# Altium schematic sheet MCU.SchDoc: MCU
size A3; DocumentNumber: MB1246; Revision: B.1; SheetNumber: 2; SheetTotal: 17; Project: STM32H7xxI-EVAL
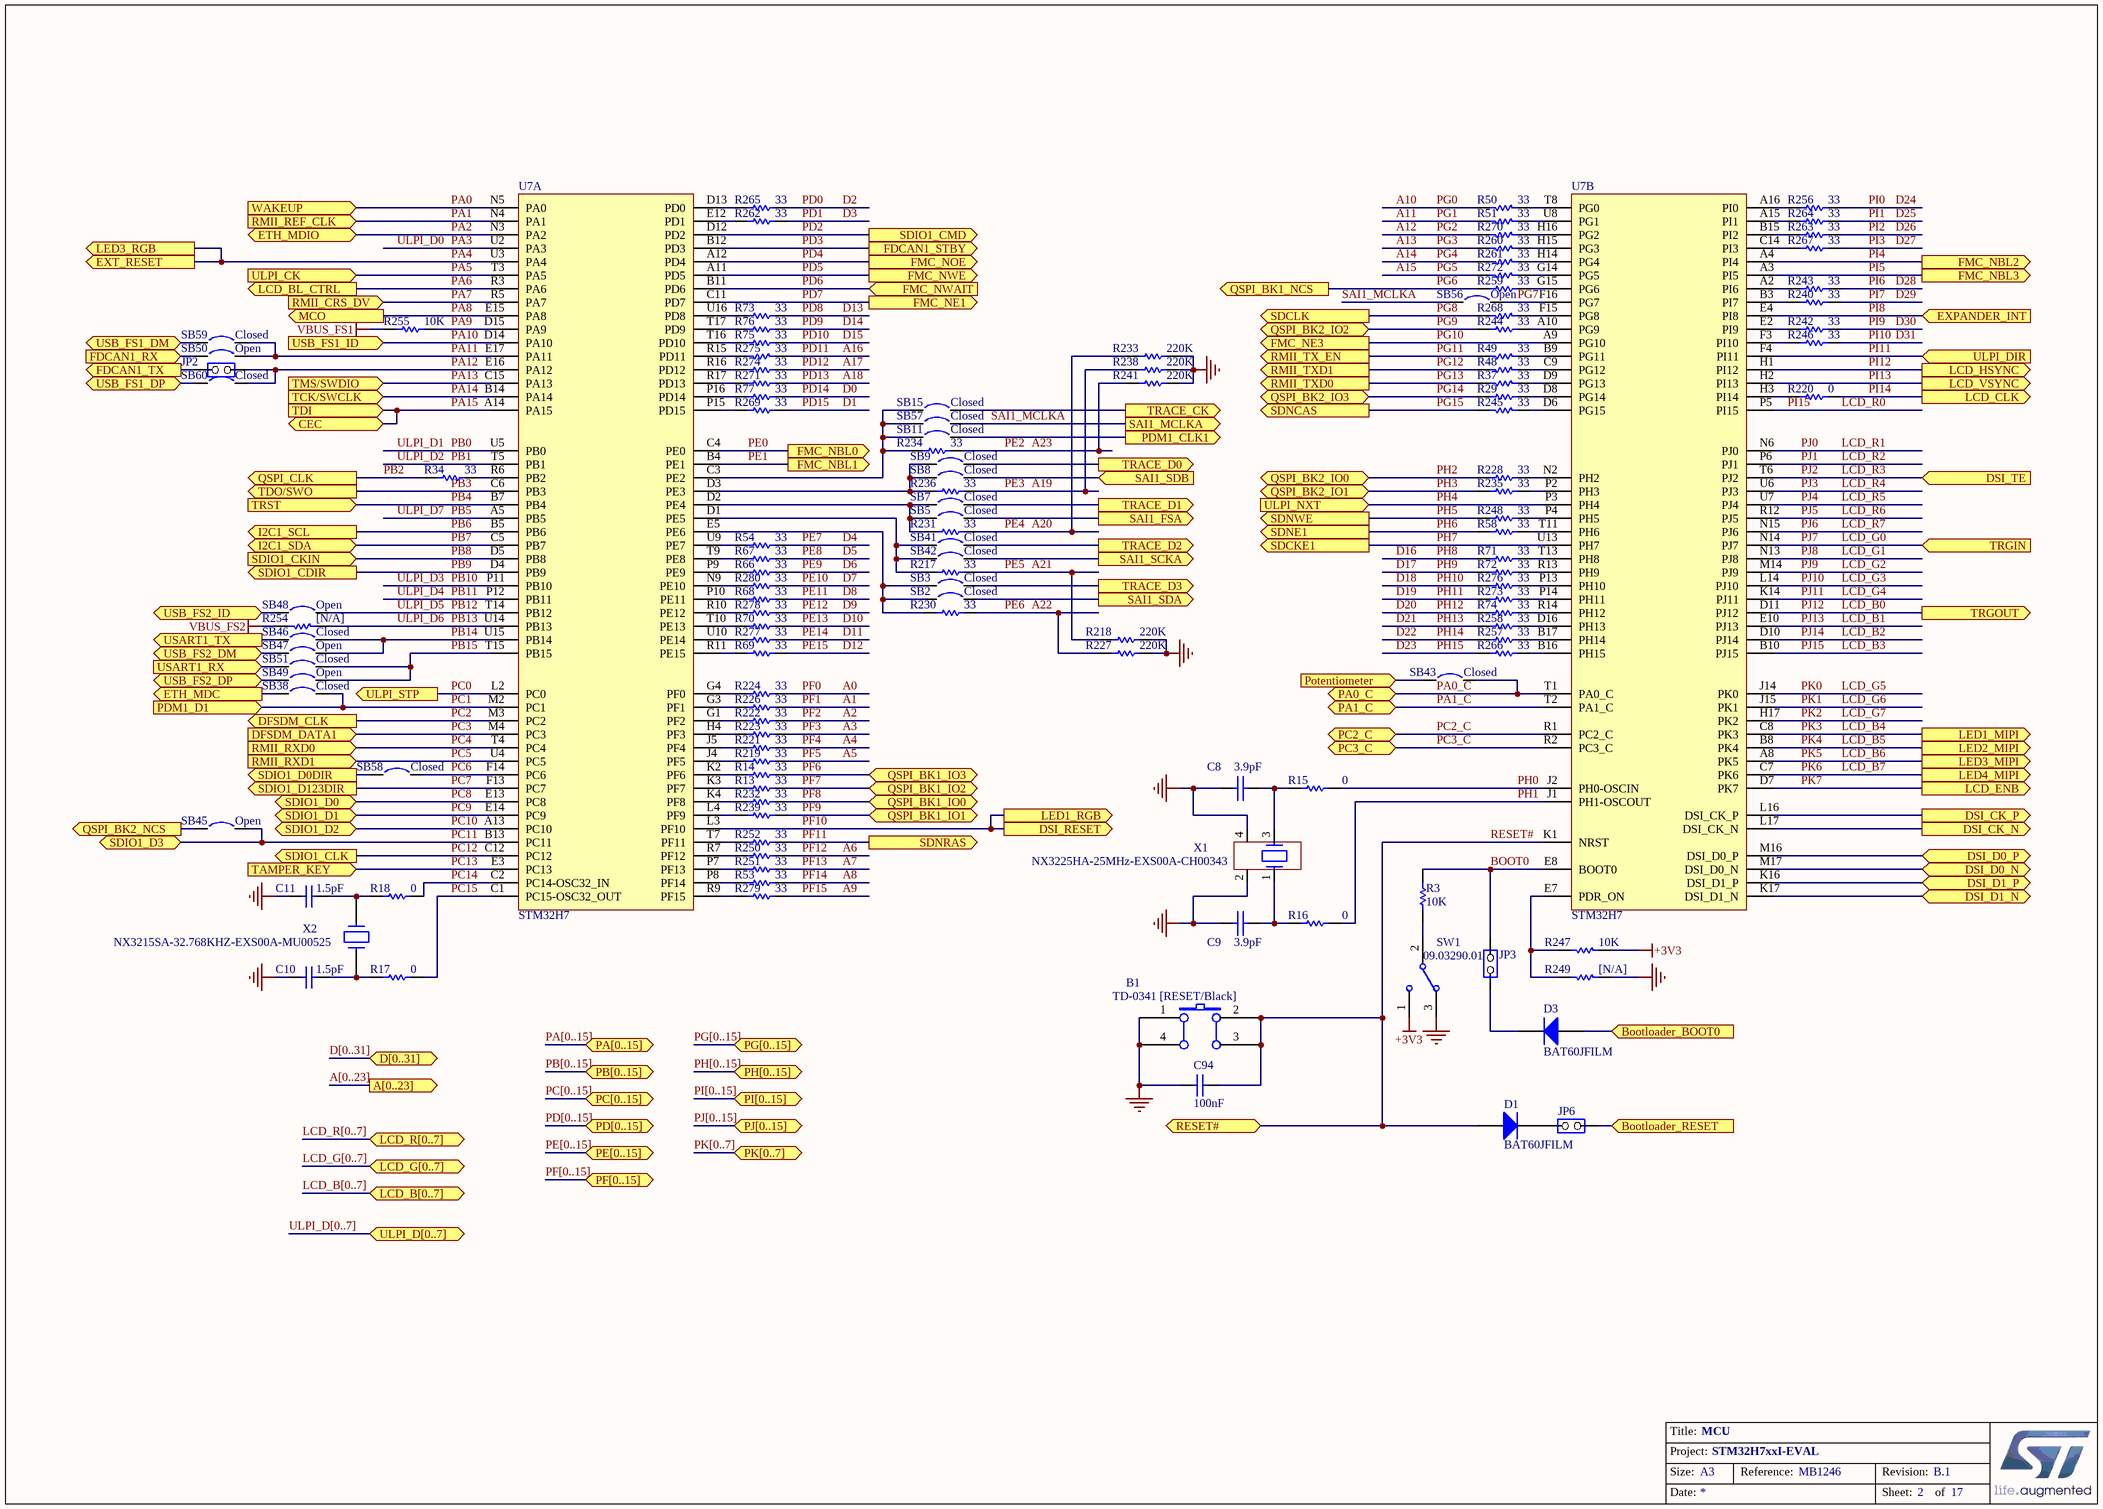
[diagram p0: MCU.SchDoc]

## Parts
B1  TD-0341 [RESET/Black]  [PB10]
C8  3.9pF  [0603C]
C9  3.9pF  [0603C]
C10  1.5pF  [0603C]
C11  1.5pF  [0603C]
C94  100nF  [0603C]
D1  BAT60JFILM  [SOD-323]
D3  BAT60JFILM  [SOD-323]
JP2  (no value)  [SIP2]
JP3  (no value)  [SIP2]
JP6  (no value)  [SIP2]
R3  10K  [0603R]
R13  33  [0402R]
R14  33  [0402R]
R15  0  [0603R]
R16  0  [0603R]
R17  0  [0402R]
R18  0  [0402R]
R29  33  [0402R]
R34  33  [0402R]
R37  33  [0603R]
R48  33  [0603R]
R49  33  [0603R]
R50  33  [0402R]
R51  33  [0402R]
R53  33  [0402R]
R54  33  [0402R]
R58  33  [0402R]
R66  33  [0402R]
R67  33  [0402R]
R68  33  [0402R]
R69  33  [0402R]
R70  33  [0402R]
R71  33  [0402R]
R72  33  [0402R]
R73  33  [0402R]
R74  33  [0402R]
R75  33  [0402R]
R76  33  [0402R]
R77  33  [0402R]
R217  33  [0402R]
R218  220K  [0603R]
R219  33  [0402R]
R220  0  [0603R]
R221  33  [0402R]
R222  33  [0402R]
R223  33  [0402R]
R224  33  [0402R]
R226  33  [0402R]
R227  220K  [0603R]
R228  33  [0402R]
R230  33  [0402R]
R231  33  [0402R]
R232  33  [0402R]
R233  220K  [0603R]
R234  33  [0402R]
R235  33  [0402R]
R236  33  [0402R]
R238  220K  [0603R]
R239  33  [0402R]
R240  33  [0402R]
R241  220K  [0603R]
R242  33  [0402R]
R243  33  [0402R]
R244  33  [0402R]
R245  33  [0402R]
R246  33  [0402R]
R247  10K  [0603R]
R248  33  [0402R]
R249  [N/A]  [0603R]
R250  33  [0402R]
R251  33  [0402R]
R252  33  [0402R]
R254  [N/A]  [0603R]
R255  10K  [0603R]
R256  33  [0402R]
R257  33  [0402R]
R258  33  [0402R]
R259  33  [0402R]
R260  33  [0402R]
R261  33  [0402R]
R262  33  [0402R]
R263  33  [0402R]
R264  33  [0402R]
R265  33  [0402R]
R266  33  [0402R]
R267  33  [0402R]
R268  33  [0402R]
R269  33  [0402R]
R270  33  [0402R]
R271  33  [0402R]
R272  33  [0402R]
R273  33  [0402R]
R274  33  [0402R]
R275  33  [0402R]
R276  33  [0402R]
R277  33  [0402R]
R278  33  [0402R]
R279  33  [0402R]
R280  33  [0402R]
SB2  Closed  [SB_0603]
SB3  Closed  [SB_0603]
SB5  Closed  [SB_0603]
SB7  Closed  [SB_0603]
SB8  Closed  [SB_0603]
SB9  Closed  [SB_0603]
SB11  Closed  [SB_0603]
SB15  Closed  [SB_0603]
SB38  Closed  [SB_0603]
SB41  Closed  [SB_0603]
SB42  Closed  [SB_0603]
SB43  Closed  [SB_0603]
SB45  Open  [SB_0603]
SB46  Closed  [SB_0603]
SB47  Open  [SB_0603]
SB48  Open  [SB_0603]
SB49  Open  [SB_0603]
SB50  Open  [SB_0603]
SB51  Closed  [SB_0603]
SB56  Open  [SB_0603]
SB57  Closed  [SB_0603]
SB58  Closed  [SB_0603]
SB59  Closed  [SB_0603]
SB60  Closed  [SB_0603]
SW1  09.03290.01  [SW1_3TH_2R54_10X2R5]
U7  STM32H7  [BGA265_0R8_14X14_SKT]  (parts A,B of 3)
X1  NX3225HA-25MHz-EXS00A-CH00343  [XTAL_4SM_3R2X2R5]
X2  NX3215SA-32.768KHZ-EXS00A-MU00525  [XTAL_2SM_3R2X1R5]

## Ports
A[0..23] (out), Bootloader_BOOT0 (in), Bootloader_RESET (in), CEC (bidir), D[0..31] (bidir), DFSDM_CLK (out), DFSDM_DATA1 (in), DSI_CK_N (out), DSI_CK_P (out), DSI_D0_N (bidir), DSI_D0_P (bidir), DSI_D1_N (bidir), DSI_D1_P (bidir), DSI_RESET (out), DSI_TE (in), ETH_MDC (out), ETH_MDIO (bidir), EXPANDER_INT (in), EXT_RESET (out), FDCAN1_RX (in), FDCAN1_STBY (out), FDCAN1_TX (out), FMC_NBL0 (out), FMC_NBL1 (out), FMC_NBL2 (out), FMC_NBL3 (out), FMC_NE1 (out), FMC_NE3 (out), FMC_NOE (out), FMC_NWAIT (in), FMC_NWE (out), I2C1_SCL (out), I2C1_SDA (bidir), LCD_B[0..7] (bidir), LCD_BL_CTRL (out), LCD_CLK (out), LCD_ENB (out), LCD_G[0..7] (bidir), LCD_HSYNC (out), LCD_R[0..7] (bidir), LCD_VSYNC (out), LED1_MIPI (out), LED1_RGB (out), LED2_MIPI (out), LED3_MIPI (out), LED3_RGB (out), LED4_MIPI (out), MCO (out), PA0_C (bidir), PA1_C (bidir), PA[0..15] (bidir), PB[0..15] (bidir), PC2_C (bidir), PC3_C (bidir), PC[0..15] (bidir), PD[0..15] (bidir), PDM1_CLK1 (out), PDM1_D1 (in), PE[0..15] (bidir), PF[0..15] (bidir), PG[0..15] (bidir), PH[0..15] (bidir), PI[0..15] (bidir), PJ[0..15] (bidir), PK[0..7] (bidir), Potentiometer (in), QSPI_BK1_IO0 (bidir), QSPI_BK1_IO1 (bidir), QSPI_BK1_IO2 (bidir), QSPI_BK1_IO3 (bidir), QSPI_BK1_NCS (out), QSPI_BK2_IO0 (bidir), QSPI_BK2_IO1 (bidir), QSPI_BK2_IO2 (bidir), QSPI_BK2_IO3 (bidir), QSPI_BK2_NCS (out), QSPI_CLK (out), RESET# (bidir), RMII_CRS_DV (in), RMII_REF_CLK (in), RMII_RXD0 (in), RMII_RXD1 (in), RMII_TX_EN (out), RMII_TXD0 (out), RMII_TXD1 (out), SAI1_FSA (out), SAI1_MCLKA (out), SAI1_SCKA (out), SAI1_SDA (out), SAI1_SDB (in), SDCKE1 (out), SDCLK (out), SDIO1_CDIR (out), SDIO1_CKIN (in), SDIO1_CLK (out), SDIO1_CMD (out), SDIO1_D0 (bidir), SDIO1_D0DIR (out), SDIO1_D1 (bidir), SDIO1_D2 (bidir), SDIO1_D3 (bidir), SDIO1_D123DIR (out), SDNCAS (out), SDNE1 (out), SDNRAS (out), SDNWE (out), TAMPER_KEY (in), TCK/SWCLK (in), TDI (in), TDO/SWO (out), TMS/SWDIO (in), TRACE_CK (out), TRACE_D0 (out), TRACE_D1 (out), TRACE_D2 (out), TRACE_D3 (out), TRGIN (in), TRGOUT (out), TRST (in), ULPI_CK (in), ULPI_D[0..7] (bidir), ULPI_DIR (in), ULPI_NXT (in), ULPI_STP (out), USART1_RX (in), USART1_TX (out), USB_FS1_DM (bidir), USB_FS1_DP (bidir), USB_FS1_ID (in), USB_FS2_DM (bidir), USB_FS2_DP (bidir), USB_FS2_ID (bidir), WAKEUP (in)

## Nets
+3V3: R247.1 SW1.1
GND: B1.1(A0) B1.4(A1) C8.2 C9.2 C10.2 C11.2 C94.1 R218.2 R227.2 R233.2 R238.2 R241.2 R249.1 SW1.3 X1.2 X1.4
VBUS_FS1: R255.1
VBUS_FS2: R254.1
A0: R224.1  [also labelled PF0]
A1: R226.1  [also labelled PF1]
A2: R222.1  [also labelled PF2]
A3: R223.1  [also labelled PF3]
A4: R221.1  [also labelled PF4]
A5: R219.1  [also labelled PF5]
A6: R250.1  [also labelled PF12]
A7: R251.1  [also labelled PF13]
A8: R53.1  [also labelled PF14]
A9: R279.1  [also labelled PF15]
A10: R50.1  [also labelled PG0]
A11: R51.1  [also labelled PG1]
A12: R270.1  [also labelled PG2]
A13: R260.1  [also labelled PG3]
A14: R261.1  [also labelled PG4]
A15: R272.1  [also labelled PG5]
A16: R275.2  [also labelled PD11]
A17: R274.1  [also labelled PD12]
A18: R271.1  [also labelled PD13]
A19: R236.1 R238.1  [also labelled PE3]
A20: R231.1 R233.1  [also labelled PE4]
A21: R217.1 R218.1  [also labelled PE5]
A22: R227.1 R230.1  [also labelled PE6]
A23: R234.1 R241.1  [also labelled PE2]
BOOT0: JP3.2(NO) R3.1 U7.E8(BOOT0)
Bootloader_BOOT0: D3.1(A) ; port Bootloader_BOOT0
Bootloader_RESET: JP6.2(NO) ; port Bootloader_RESET
D0: R77.1  [also labelled PD14]
D1: R269.1  [also labelled PD15]
D2: R265.1  [also labelled PD0]
D3: R262.1  [also labelled PD1]
D4: R54.1  [also labelled PE7]
D5: R67.1  [also labelled PE8]
D6: R66.1  [also labelled PE9]
D7: R280.1  [also labelled PE10]
D8: R68.1  [also labelled PE11]
D9: R278.1  [also labelled PE12]
D10: R70.1  [also labelled PE13]
D11: R277.1  [also labelled PE14]
D12: R69.1  [also labelled PE15]
D13: R73.1  [also labelled PD8]
D14: R76.1  [also labelled PD9]
D15: R75.1  [also labelled PD10]
D16: R71.2  [also labelled PH8]
D17: R72.2  [also labelled PH9]
D18: R276.2  [also labelled PH10]
D19: R273.2  [also labelled PH11]
D20: R74.2  [also labelled PH12]
D21: R258.2  [also labelled PH13]
D22: R257.2  [also labelled PH14]
D23: R266.2  [also labelled PH15]
D24: R256.1  [also labelled PI0]
D25: R264.1  [also labelled PI1]
D26: R263.1  [also labelled PI2]
D27: R267.1  [also labelled PI3]
D28: R243.1  [also labelled PI6]
D29: R240.1  [also labelled PI7]
D30: R242.1  [also labelled PI9]
D31: R246.1  [also labelled PI10]
DSI_CK_N: U7.L17(DSI_CK_N) ; port DSI_CK_N
DSI_CK_P: U7.L16(DSI_CK_P) ; port DSI_CK_P
DSI_D0_N: U7.M17(DSI_D0_N) ; port DSI_D0_N
DSI_D0_P: U7.M16(DSI_D0_P) ; port DSI_D0_P
DSI_D1_N: U7.K17(DSI_D1_N) ; port DSI_D1_N
DSI_D1_P: U7.K16(DSI_D1_P) ; port DSI_D1_P
ETH_MDC: SB38.1 ; port ETH_MDC
FDCAN1_RX: SB50.1 ; port FDCAN1_RX
FDCAN1_TX: JP2.2(NO) ; port FDCAN1_TX
LCD_B0: U7.D11(PJ12) ; port TRGOUT  [also labelled PJ12]
LCD_B1: U7.E10(PJ13)  [also labelled PJ13]
LCD_B2: U7.D10(PJ14)  [also labelled PJ14]
LCD_B3: U7.B10(PJ15)  [also labelled PJ15]
LCD_B4: U7.C8(PK3) ; port LED1_MIPI  [also labelled PK3]
LCD_B5: U7.B8(PK4) ; port LED2_MIPI  [also labelled PK4]
LCD_B6: U7.A8(PK5) ; port LED3_MIPI  [also labelled PK5]
LCD_B7: U7.C7(PK6) ; port LED4_MIPI  [also labelled PK6]
LCD_G0: U7.N14(PJ7) ; port TRGIN  [also labelled PJ7]
LCD_G1: U7.N13(PJ8)  [also labelled PJ8]
LCD_G2: U7.M14(PJ9)  [also labelled PJ9]
LCD_G3: U7.L14(PJ10)  [also labelled PJ10]
LCD_G4: U7.K14(PJ11)  [also labelled PJ11]
LCD_G5: U7.J14(PK0)  [also labelled PK0]
LCD_G6: U7.J15(PK1)  [also labelled PK1]
LCD_G7: U7.H17(PK2)  [also labelled PK2]
LCD_R0: U7.P5(PI15)  [also labelled PI15]
LCD_R1: U7.N6(PJ0)  [also labelled PJ0]
LCD_R2: U7.P6(PJ1)  [also labelled PJ1]
LCD_R3: U7.T6(PJ2) ; port DSI_TE  [also labelled PJ2]
LCD_R4: U7.U6(PJ3)  [also labelled PJ3]
LCD_R5: U7.U7(PJ4)  [also labelled PJ4]
LCD_R6: U7.R12(PJ5)  [also labelled PJ5]
LCD_R7: U7.N15(PJ6)  [also labelled PJ6]
PA0: U7.N5(PA0) ; port WAKEUP
PA0_C: SB43.1 U7.T1(PA0_C) ; port PA0_C
PA1: U7.N4(PA1) ; port RMII_REF_CLK
PA1_C: U7.T2(PA1_C) ; port PA1_C
PA2: U7.N3(PA2) ; port ETH_MDIO
PA3: U7.U2(PA3)  [also labelled ULPI_D0]
PA4: U7.U3(PA4) ; port EXT_RESET, port LED3_RGB
PA5: U7.T3(PA5) ; port ULPI_CK
PA6: U7.R3(PA6) ; port LCD_BL_CTRL
PA7: U7.R5(PA7) ; port RMII_CRS_DV
PA8: U7.E15(PA8) ; port MCO
PA9: R255.2 U7.D15(PA9)
PA10: U7.D14(PA10) ; port USB_FS1_ID
PA11: SB50.2 SB59.2 U7.E17(PA11)
PA12: JP2.1(COMMON) SB60.2 U7.E16(PA12)
PA13: U7.C15(PA13) ; port TMS/SWDIO
PA14: U7.B14(PA14) ; port TCK/SWCLK
PA15: U7.A14(PA15) ; port TDI, port CEC
PB0: U7.U5(PB0)  [also labelled ULPI_D1]
PB1: U7.T5(PB1)  [also labelled ULPI_D2]
PB2: R34.2 ; port QSPI_CLK
PB3: U7.C6(PB3) ; port TDO/SWO
PB4: U7.B7(PB4) ; port TRST
PB5: U7.A5(PB5)  [also labelled ULPI_D7]
PB6: U7.B5(PB6) ; port I2C1_SCL
PB7: U7.C5(PB7) ; port I2C1_SDA
PB8: U7.D5(PB8) ; port SDIO1_CKIN
PB9: U7.D4(PB9) ; port SDIO1_CDIR
PB10: U7.P11(PB10)  [also labelled ULPI_D3]
PB11: U7.P12(PB11)  [also labelled ULPI_D4]
PB12: SB48.2 U7.T14(PB12)  [also labelled ULPI_D5]
PB13: R254.2 U7.U14(PB13)  [also labelled ULPI_D6]
PB14: SB46.2 SB47.2 U7.U15(PB14)
PB15: SB49.2 SB51.2 U7.T15(PB15)
PC0: U7.L2(PC0) ; port ULPI_STP
PC1: SB38.2 U7.M2(PC1) ; port PDM1_D1
PC2: U7.M3(PC2) ; port DFSDM_CLK
PC2_C: U7.R1(PC2_C) ; port PC2_C
PC3: U7.M4(PC3) ; port DFSDM_DATA1
PC3_C: U7.R2(PC3_C) ; port PC3_C
PC4: U7.T4(PC4) ; port RMII_RXD0
PC5: U7.U4(PC5) ; port RMII_RXD1
PC6: SB58.1 U7.F14(PC6)
PC7: U7.F13(PC7) ; port SDIO1_D123DIR
PC8: U7.E13(PC8) ; port SDIO1_D0
PC9: U7.E14(PC9) ; port SDIO1_D1
PC10: U7.A13(PC10) ; port SDIO1_D2
PC11: SB45.2 U7.B13(PC11) ; port SDIO1_D3
PC12: U7.C12(PC12) ; port SDIO1_CLK
PC13: U7.E3(PC13) ; port TAMPER_KEY
PC14: R18.1 U7.C2(PC14-OSC32_IN)
PC15: R17.1 U7.C1(PC15-OSC32_OUT)
PD2: U7.D12(PD2) ; port SDIO1_CMD
PD3: U7.B12(PD3) ; port FDCAN1_STBY
PD4: U7.A12(PD4) ; port FMC_NOE
PD5: U7.A11(PD5) ; port FMC_NWE
PD6: U7.B11(PD6) ; port FMC_NWAIT
PD7: U7.C11(PD7) ; port FMC_NE1
PDM1_CLK1: SB11.1 ; port PDM1_CLK1
PE0: U7.C4(PE0) ; port FMC_NBL0
PE1: U7.B4(PE1) ; port FMC_NBL1
PF6: R14.1 ; port QSPI_BK1_IO3
PF7: R13.1 ; port QSPI_BK1_IO2
PF8: R232.1 ; port QSPI_BK1_IO0
PF9: R239.1 ; port QSPI_BK1_IO1
PF10: U7.L3(PF10) ; port DSI_RESET, port LED1_RGB
PF11: R252.1 ; port SDNRAS
PG6: R259.2 ; port QSPI_BK1_NCS
PG7: SB56.2 U7.F16(PG7)
PG8: R268.1 ; port SDCLK
PG9: R244.2 ; port QSPI_BK2_IO2
PG10: U7.A9(PG10) ; port FMC_NE3
PG11: R49.1 ; port RMII_TX_EN
PG12: R48.1 ; port RMII_TXD1
PG13: R37.1 ; port RMII_TXD0
PG14: R29.2 ; port QSPI_BK2_IO3
PG15: R245.1 ; port SDNCAS
PH0: R15.2 U7.J2(PH0-OSCIN)
PH1: R16.2 U7.J1(PH1-OSCOUT)
PH2: R228.2 ; port QSPI_BK2_IO0
PH3: R235.2 ; port QSPI_BK2_IO1
PH4: U7.P3(PH4) ; port ULPI_NXT
PH5: R248.2 ; port SDNWE
PH6: R58.2 ; port SDNE1
PH7: U7.U13(PH7) ; port SDCKE1
PI4: U7.A4(PI4) ; port FMC_NBL2
PI5: U7.A3(PI5) ; port FMC_NBL3
PI8: U7.E4(PI8) ; port EXPANDER_INT
PI11: U7.F4(PI11) ; port ULPI_DIR
PI12: U7.H1(PI12) ; port LCD_HSYNC
PI13: U7.H2(PI13) ; port LCD_VSYNC
PI14: R220.1 ; port LCD_CLK
PK7: U7.D7(PK7) ; port LCD_ENB
Potentiometer: SB43.2 ; port Potentiometer
QSPI_BK2_NCS: SB45.1 ; port QSPI_BK2_NCS
RESET#: B1.2(B0) B1.3(B1) C94.2 D1.1(A) U7.K1(NRST) ; port RESET#
SAI1_FSA: SB5.1 ; port SAI1_FSA
SAI1_MCLKA: SB56.1 SB57.1 ; port SAI1_MCLKA
SAI1_SCKA: SB42.1 ; port SAI1_SCKA
SAI1_SDA: SB2.1 ; port SAI1_SDA
SAI1_SDB: SB8.1 ; port SAI1_SDB
SDIO1_D0DIR: SB58.2 ; port SDIO1_D0DIR
TRACE_CK: SB15.1 ; port TRACE_CK
TRACE_D0: SB9.1 ; port TRACE_D0
TRACE_D1: SB7.1 ; port TRACE_D1
TRACE_D2: SB41.1 ; port TRACE_D2
TRACE_D3: SB3.1 ; port TRACE_D3
USART1_RX: SB51.1 ; port USART1_RX
USART1_TX: SB46.1 ; port USART1_TX
USB_FS1_DM: SB59.1 ; port USB_FS1_DM
USB_FS1_DP: SB60.1 ; port USB_FS1_DP
USB_FS2_DM: SB47.1 ; port USB_FS2_DM
USB_FS2_DP: SB49.1 ; port USB_FS2_DP
USB_FS2_ID: SB48.1 ; port USB_FS2_ID
NetC8_1: C8.1 R15.1 X1.3
NetC9_1: C9.1 R16.1 X1.1
NetC10_1: C10.1 R17.2 X2.1
NetC11_1: C11.1 R18.2 X2.2
NetD1_2: D1.2(K) JP6.1(COMMON)
NetD3_2: D3.2(K) JP3.1(COMMON)
NetR3_2: R3.2 SW1.2
NetR13_2: R13.2 U7.K3(PF7)
NetR14_2: R14.2 U7.K2(PF6)
NetR29_1: R29.1 U7.D8(PG14)
NetR34_1: R34.1 U7.R6(PB2)
NetR37_2: R37.2 U7.D9(PG13)
NetR48_2: R48.2 U7.C9(PG12)
NetR49_2: R49.2 U7.B9(PG11)
NetR50_2: R50.2 U7.T8(PG0)
NetR51_2: R51.2 U7.U8(PG1)
NetR53_2: R53.2 U7.P8(PF14)
NetR54_2: R54.2 U7.U9(PE7)
NetR58_1: R58.1 U7.T11(PH6)
NetR66_2: R66.2 U7.P9(PE9)
NetR67_2: R67.2 U7.T9(PE8)
NetR68_2: R68.2 U7.P10(PE11)
NetR69_2: R69.2 U7.R11(PE15)
NetR70_2: R70.2 U7.T10(PE13)
NetR71_1: R71.1 U7.T13(PH8)
NetR72_1: R72.1 U7.R13(PH9)
NetR73_2: R73.2 U7.U16(PD8)
NetR74_1: R74.1 U7.R14(PH12)
NetR75_2: R75.2 U7.T16(PD10)
NetR76_2: R76.2 U7.T17(PD9)
NetR77_2: R77.2 U7.P16(PD14)
NetR217_2: R217.2 SB41.2 SB42.2 U7.D1(PE5)
NetR219_2: R219.2 U7.J4(PF5)
NetR220_2: R220.2 U7.H3(PI14)
NetR221_2: R221.2 U7.J5(PF4)
NetR222_2: R222.2 U7.G1(PF2)
NetR223_2: R223.2 U7.H4(PF3)
NetR224_2: R224.2 U7.G4(PF0)
NetR226_2: R226.2 U7.G3(PF1)
NetR228_1: R228.1 U7.N2(PH2)
NetR230_2: R230.2 SB2.2 SB3.2 U7.E5(PE6)
NetR231_2: R231.2 SB5.2 SB7.2 U7.D2(PE4)
NetR232_2: R232.2 U7.K4(PF8)
NetR234_2: R234.2 SB11.2 SB15.2 SB57.2 U7.C3(PE2)
NetR235_1: R235.1 U7.P2(PH3)
NetR236_2: R236.2 SB8.2 SB9.2 U7.D3(PE3)
NetR239_2: R239.2 U7.L4(PF9)
NetR240_2: R240.2 U7.B3(PI7)
NetR242_2: R242.2 U7.E2(PI9)
NetR243_2: R243.2 U7.A2(PI6)
NetR244_1: R244.1 U7.A10(PG9)
NetR245_2: R245.2 U7.D6(PG15)
NetR246_2: R246.2 U7.F3(PI10)
NetR247_2: R247.2 R249.2 U7.E7(PDR_ON)
NetR248_1: R248.1 U7.P4(PH5)
NetR250_2: R250.2 U7.R7(PF12)
NetR251_2: R251.2 U7.P7(PF13)
NetR252_2: R252.2 U7.T7(PF11)
NetR256_2: R256.2 U7.A16(PI0)
NetR257_1: R257.1 U7.B17(PH14)
NetR258_1: R258.1 U7.D16(PH13)
NetR259_1: R259.1 U7.G15(PG6)
NetR260_2: R260.2 U7.H15(PG3)
NetR261_2: R261.2 U7.H14(PG4)
NetR262_2: R262.2 U7.E12(PD1)
NetR263_2: R263.2 U7.B15(PI2)
NetR264_2: R264.2 U7.A15(PI1)
NetR265_2: R265.2 U7.D13(PD0)
NetR266_1: R266.1 U7.B16(PH15)
NetR267_2: R267.2 U7.C14(PI3)
NetR268_2: R268.2 U7.F15(PG8)
NetR269_2: R269.2 U7.P15(PD15)
NetR270_2: R270.2 U7.H16(PG2)
NetR271_2: R271.2 U7.R17(PD13)
NetR272_2: R272.2 U7.G14(PG5)
NetR273_1: R273.1 U7.P14(PH11)
NetR274_2: R274.2 U7.R16(PD12)
NetR275_1: R275.1 U7.R15(PD11)
NetR276_1: R276.1 U7.P13(PH10)
NetR277_2: R277.2 U7.U10(PE14)
NetR278_2: R278.2 U7.R10(PE12)
NetR279_2: R279.2 U7.R9(PF15)
NetR280_2: R280.2 U7.N9(PE10)

## Buses and harness runs
bus A[0..23] = port A[0..23]
bus D[0..31] = port D[0..31]
bus LCD_B[0..7] = port LCD_B[0..7]
bus LCD_G[0..7] = port LCD_G[0..7]
bus LCD_R[0..7] = port LCD_R[0..7]
bus PA[0..15] = port PA[0..15]
bus PB[0..15] = port PB[0..15]
bus PC[0..15] = port PC[0..15]
bus PD[0..15] = port PD[0..15]
bus PE[0..15] = port PE[0..15]
bus PF[0..15] = port PF[0..15]
bus PG[0..15] = port PG[0..15]
bus PH[0..15] = port PH[0..15]
bus PI[0..15] = port PI[0..15]
bus PJ[0..15] = port PJ[0..15]
bus PK[0..7] = port PK[0..7]
bus ULPI_D[0..7] = port ULPI_D[0..7]

## Notes on the sheet
- Title:
- Project:
- Size:
- Date:
- A3
- Reference:
- Sheet:
- Revision:
- of

## Library data of the parts
B1 = SW PUSHBUTTON: SE PUSHBUTTON
C8 C9 = CAP: Capacitor
C10 C11 = Capacitor_ST: Capacitor 0402 / 0603 / 0805; Value: 100nF; Revision: July-2002: Re-released for DXP Platform.
C94 = CAP: Capacitor; Value: 100pF; Published: 8-Jun-2000; Revision: July-2002: Re-released for DXP Platform.; Publisher: Altium Limited
D1 D3 = Diode: Default Diode; Code - JEDEC: DO-214-AB; Published: 8-Jun-2000; Revision: July-2002: Re-released for DXP Platform.; Publisher: Altium Limited
JP2 JP3 JP6 = JP2
R3 R218 R227 R233 R238 R241 = res1: Resistor; Value: 1K; Published: 8-Jun-2000; Revision: July-2002: Re-released for DXP Platform.; Publisher: Altium Limited
R13-R18 R29 R34 R37 R48-R51 R53 R54 R58 R66-R77 R217 R219-R224 R226 R228 R230-R232 R234-R236 R239 R240 R242-R252 R254-R280 = Res1: Resistor; Value: 1K; Published: 8-Jun-2000; Revision: July-2002: Re-released for DXP Platform.; Publisher: Altium Limited
SB2 SB3 SB5 SB7-SB9 SB11 SB15 SB38 SB41-SB43 SB46 SB51 SB57-SB60 = Circuit Breaker_close: Circuit Breaker; Published: 24-Mar-1999; Revision: July-2002: Re-released for DXP Platform.; Publisher: Altium Limited
SB45 SB47-SB50 SB56 = Circuit Breaker: Published: 24-Mar-1999; Revision: July-2002: Re-released for DXP Platform.; Publisher: Altium Limited
SW1 = SW-SPDT: SPDT Subminiature Toggle Switch, Right Angle Mounting, Vertical Actuation; Revision 1: Jul-2002: Re-released for DXP Platform.; Revision 2: 17-Dec-2003: Schematic revised, PCB Footprint replaced.; Published: 24-Mar-1999; Datasheet: Latest Revision: 05-Dec-2000; Publisher: Altium Limited
U7 = STM32H7_TFBGA265
X2 = CRYSTAL_32K: Crystal